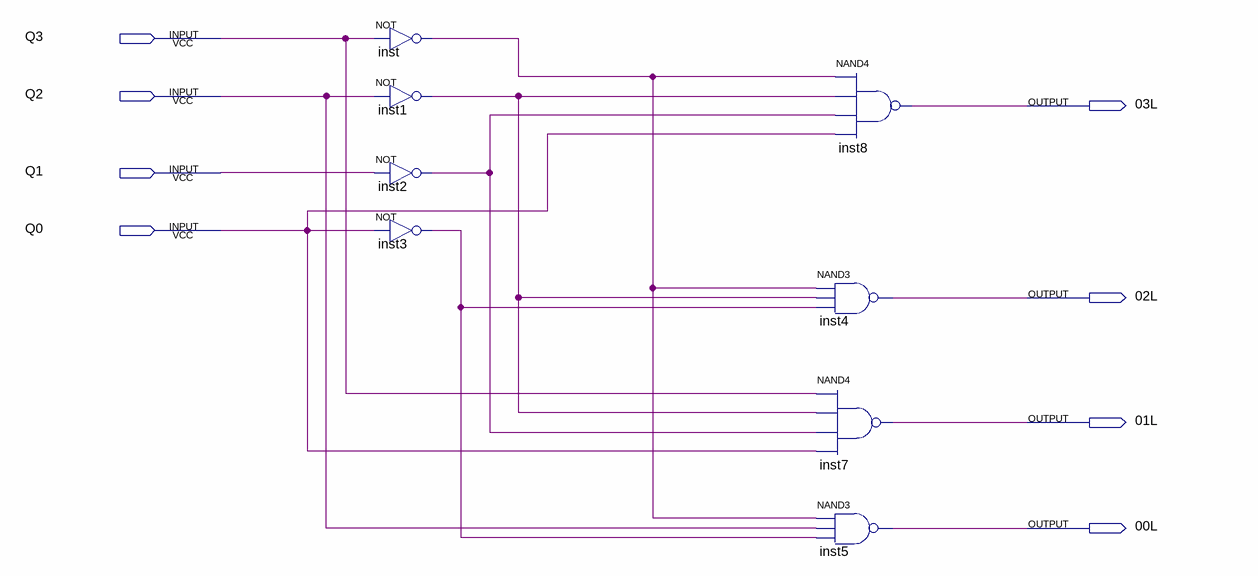
[diagram p0: schematic sheet]
// Quartus schematic Peatonales.bdf as structural Verilog: 8 symbols, 8 pins
module Peatonales (
  input  Q3,
  input  Q2,
  input  Q1,
  input  Q0,
  output \03L ,
  output \02L ,
  output \01L ,
  output \00L 
);

  wire inst1_out, inst2_out, inst3_out, inst_out;

  not inst (inst_out, Q3);
  not inst1 (inst1_out, Q2);
  not inst2 (inst2_out, Q1);
  not inst3 (inst3_out, Q0);
  nand inst8 (\03L , inst_out, inst1_out, inst2_out, Q0);
  nand inst4 (\02L , inst_out, inst1_out, inst3_out);
  nand inst7 (\01L , Q3, inst1_out, inst2_out, Q0);
  nand inst5 (\00L , inst_out, Q2, inst3_out);
endmodule
